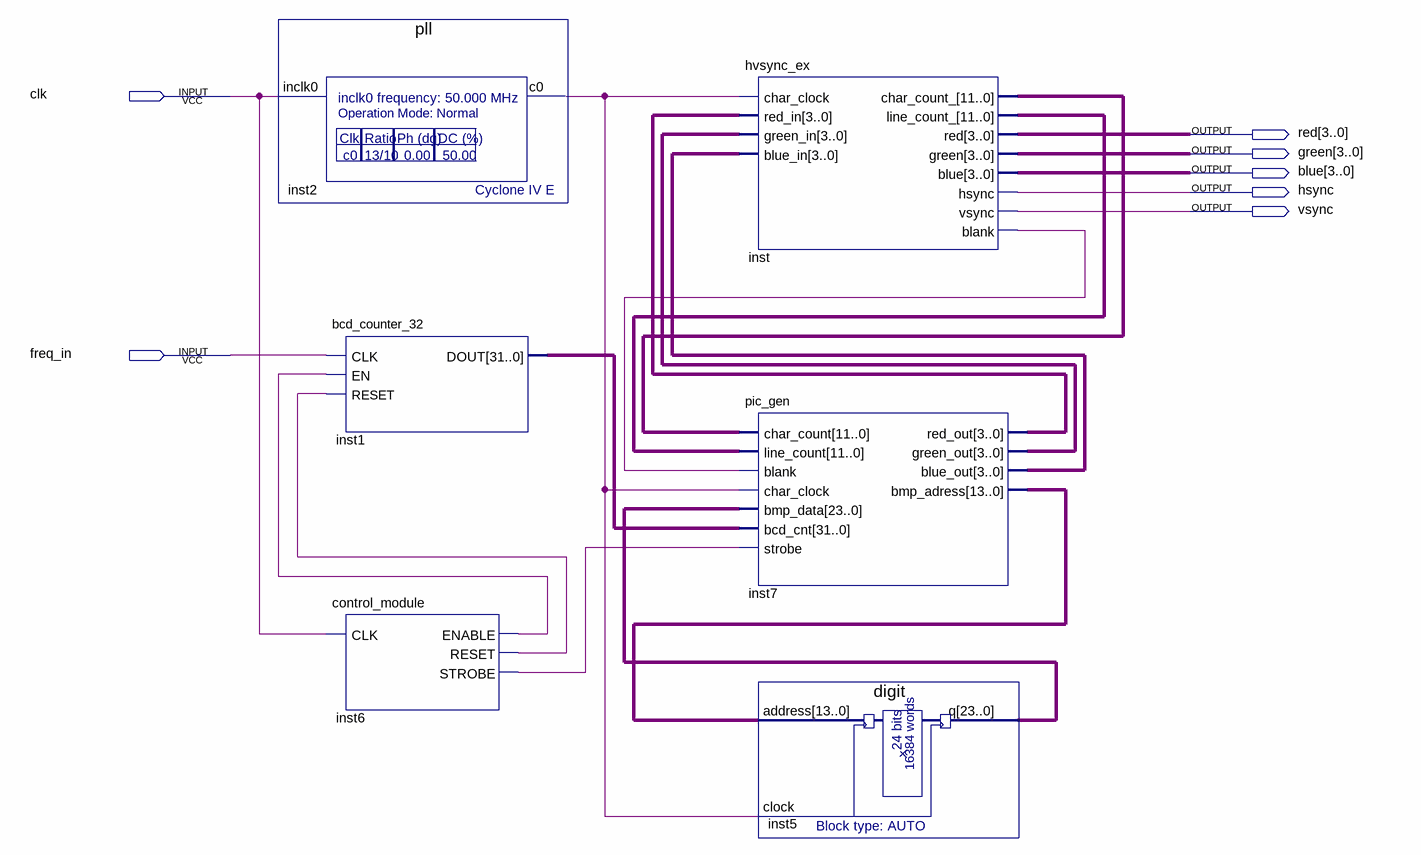
[diagram p0: schematic sheet]
// Quartus schematic freq_count.bdf as structural Verilog: 6 symbols, 7 pins
module freq_count (
  input  clk,
  input  freq_in,
  output [3:0] red,
  output [3:0] green,
  output [3:0] blue,
  output hsync,
  output vsync
);

  wire inst2_c0, inst6_enable, inst6_reset, inst6_strobe, inst_blank;
  wire [3:0] inst7_blue_out, inst7_green_out, inst7_red_out;
  wire [11:0] inst_char_count_, inst_line_count_;
  wire [13:0] inst7_bmp_adress;
  wire [23:0] inst5_q;
  wire [31:0] inst1_dout;

  pll inst2 (.inclk0(clk), .c0(inst2_c0));
  bcd_counter_32 inst1 (.CLK(freq_in), .EN(inst6_enable), .RESET(inst6_reset), .DOUT(inst1_dout));
  control_module inst6 (.CLK(clk), .ENABLE(inst6_enable), .RESET(inst6_reset), .STROBE(inst6_strobe));
  hvsync_ex inst (
    .char_clock(inst2_c0), .red_in(inst7_red_out), .green_in(inst7_green_out), .blue_in(inst7_blue_out),
    .char_count_(inst_char_count_), .line_count_(inst_line_count_), .red(red), .green(green), .blue(blue),
    .hsync(hsync), .vsync(vsync), .blank(inst_blank));
  pic_gen inst7 (
    .char_count(inst_char_count_), .line_count(inst_line_count_), .blank(inst_blank), .char_clock(inst2_c0),
    .bmp_data(inst5_q), .bcd_cnt(inst1_dout), .strobe(inst6_strobe), .red_out(inst7_red_out),
    .green_out(inst7_green_out), .blue_out(inst7_blue_out), .bmp_adress(inst7_bmp_adress));
  digit inst5 (.address(inst7_bmp_adress), .clock(inst2_c0), .q(inst5_q));
endmodule
